# EAGLE schematic main (EAGLE 7.1.0)
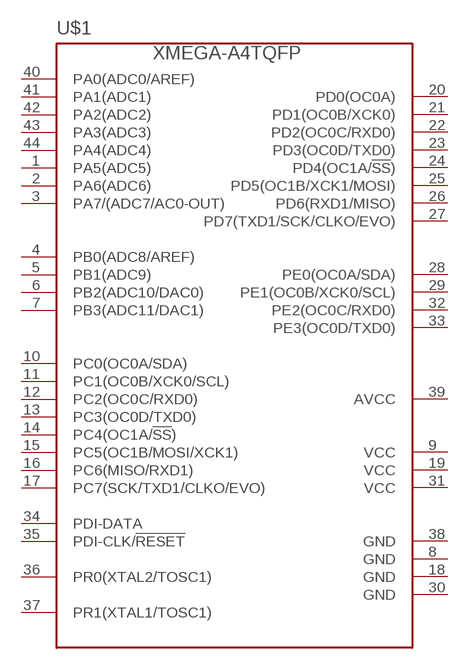
[diagram p0: schematic, sheet 1]

## Parts
U$1  XMEGA-A4TQFP  [TQFP44]
Unconnected: U$1.1(PA5(ADC5)) U$1.2(PA6(ADC6)) U$1.3(PA7/(ADC7/AC0-OUT)) U$1.4(PB0(ADC8/AREF)) U$1.5(PB1(ADC9)) U$1.6(PB2(ADC10/DAC0)) U$1.7(PB3(ADC11/DAC1)) U$1.10(PC0(OC0A/SDA)) U$1.11(PC1(OC0B/XCK0/SCL)) U$1.12(PC2(OC0C/RXD0)) U$1.13(PC3(OC0D/TXD0)) U$1.14(PC4(OC1A/!SS!)) U$1.15(PC5(OC1B/MOSI/XCK1)) U$1.16(PC6(MISO/RXD1)) U$1.17(PC7(SCK/TXD1/CLKO/EVO)) U$1.20(PD0(OC0A)) U$1.21(PD1(OC0B/XCK0)) U$1.22(PD2(OC0C/RXD0)) U$1.23(PD3(OC0D/TXD0)) U$1.24(PD4(OC1A/!SS!)) U$1.25(PD5(OC1B/XCK1/MOSI)) U$1.26(PD6(RXD1/MISO)) U$1.27(PD7(TXD1/SCK/CLKO/EVO)) U$1.28(PE0(OC0A/SDA)) U$1.29(PE1(OC0B/XCK0/SCL)) U$1.32(PE2(OC0C/RXD0)) U$1.33(PE3(OC0D/TXD0)) U$1.34(PDI-DATA) U$1.35(PDI-CLK/!RESET) U$1.36(PR0(XTAL2/TOSC1)) U$1.37(PR1(XTAL1/TOSC1)) U$1.40(PA0(ADC0/AREF)) U$1.41(PA1(ADC1)) U$1.42(PA2(ADC2)) U$1.43(PA3(ADC3)) U$1.44(PA4(ADC4))

## Power pins joined to a net without a drawn wire
AVCC: U$1.39(AVCC)
GND: U$1.8(GND) U$1.18(GND) U$1.30(GND) U$1.38(GND)
VCC: U$1.9(VCC) U$1.19(VCC) U$1.31(VCC)

## Library data of the parts
U$1 = avr-7:XMEGA-A4: Atmel XMega A4 series processor